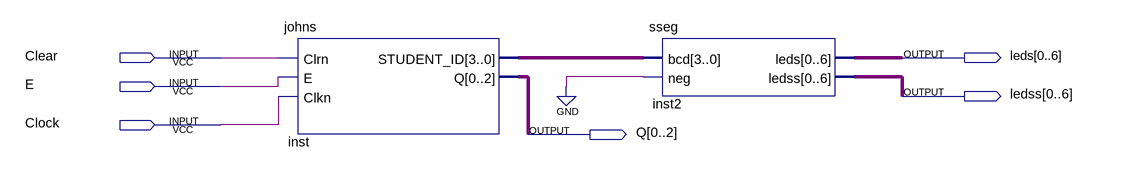
[diagram p0: schematic sheet]
// Quartus schematic johnsModified.bdf as structural Verilog: 2 symbols, 6 pins
module johnsModified (
  input  Clear,
  input  E,
  input  Clock,
  output [0:6] leds,
  output [0:6] ledss,
  output [0:2] Q
);

  wire [3:0] inst_student_id;

  johns inst (.Clrn(Clear), .E(E), .Clkn(Clock), .STUDENT_ID(inst_student_id), .Q(Q));
  sseg inst2 (.bcd(inst_student_id), .neg(1'b0), .leds(leds), .ledss(ledss));
endmodule
